# Altium schematic sheet STM32F100CxT_simple.SchDoc
size A4
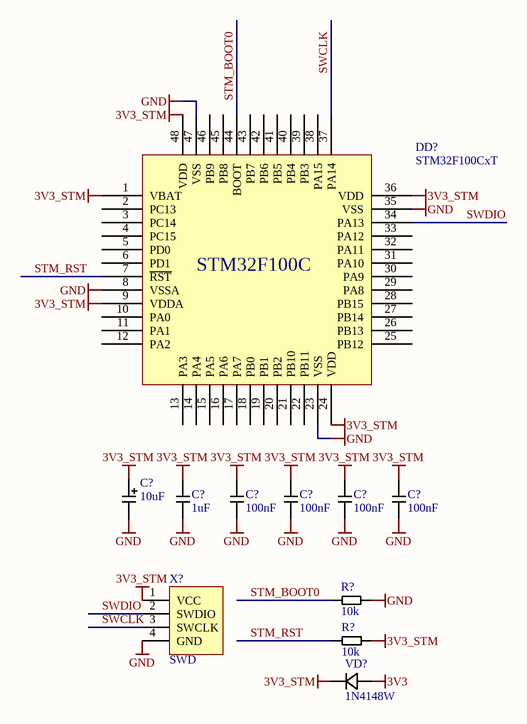
[diagram p0: STM32F100CxT_simple.SchDoc]

## Parts
(Parts that share a designator on the sheet are numbered #1, #2 ... from top to bottom, then left to right.)
C?#1  10uF  [SMD A]
C?#2  1uF  [C0603]
C?#3  100nF  [C0603]
C?#4  100nF  [C0603]
C?#5  100nF  [C0603]
C?#6  100nF  [C0603]
DD?  STM32F100CxT  [LQFP-48]
R?#1  10k  [R0603]
R?#2  10k  [R0603]
VD?  1N4148W  [SOD-123]
X?  SWD  [SWD-4]

## Nets
3V3: VD?.1(K)
3V3_STM: C?#1.1 C?#2.1 C?#3.1 C?#4.1 C?#5.1 C?#6.1 DD?.1(VBAT) DD?.9(VDDA) DD?.24(VDD) DD?.36(VDD) DD?.48(VDD) R?#2.2 VD?.2(A) X?.1(VCC)
GND: C?#1.2 C?#2.2 C?#3.2 C?#4.2 C?#5.2 C?#6.2 DD?.8(VSSA) DD?.23(VSS) DD?.35(VSS) DD?.47(VSS) R?#1.1 X?.4(GND)
STM_BOOT0: DD?.44(BOOT) R?#1.2
STM_RST: DD?.7(~{RST}) R?#2.1
SWCLK: DD?.37(PA14) X?.3(SWCLK)
SWDIO: DD?.34(PA13) X?.2(SWDIO)

Not connected (* = marked no-connect by the designer): DD? 2(PC13) 3(PC14) 4(PC15) 5(PD0) 6(PD1) 10(PA0) 11(PA1) 12(PA2) 13(PA3) 14(PA4) 15(PA5) 16(PA6) 17(PA7) 18(PB0) 19(PB1) 20(PB2) 21(PB10) 22(PB11) 25(PB12) 26(PB13) 27(PB14) 28(PB15) 29(PA8) 30(PA9) 31(PA10) 32(PA11) 33(PA12) 38(PA15) 39(PB3) 40(PB4) 41(PB5) 42(PB6) 43(PB7) 45(PB8) 46(PB9)

## Notes on the sheet
- (in symbol STM32F100CxT) STM32F100C

## Library data of the parts
C?#1 = CP: Capacitor polarized
C?#2-C?#6 = C: Capacitor
DD? = STM32F100CxT: STM Microcontroller
R?#1 R?#2 = R: Resistor
VD? = Diode: SMD diode
X? = SWD_4: SWD connector